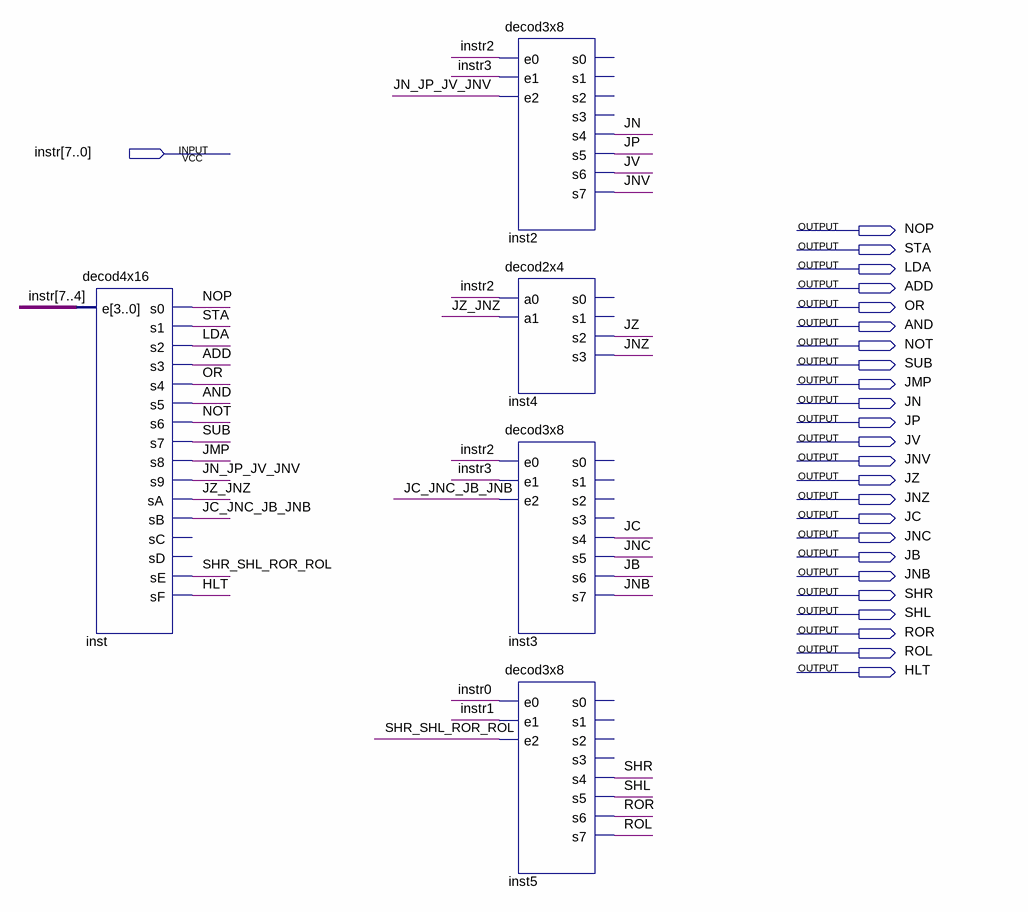
[diagram p0: schematic sheet]
// Quartus schematic Ahmes_instr_decod.bdf as structural Verilog: 5 symbols, 25 pins
module Ahmes_instr_decod (
  input  [7:0] instr,
  output NOP,
  output STA,
  output LDA,
  output ADD,
  output OR,
  output AND,
  output NOT,
  output SUB,
  output JMP,
  output JN,
  output JP,
  output JV,
  output JNV,
  output JZ,
  output JNZ,
  output JC,
  output JNC,
  output JB,
  output JNB,
  output SHR,
  output SHL,
  output ROR,
  output ROL,
  output HLT
);

  wire JC_JNC_JB_JNB, JN_JP_JV_JNV, JZ_JNZ, SHR_SHL_ROR_ROL;

  decod4x16 inst (
    .e(instr[7:4]), .s0(NOP), .s1(STA), .s2(LDA), .s3(ADD), .s4(OR), .s5(AND), .s6(NOT), .s7(SUB), .s8(JMP),
    .s9(JN_JP_JV_JNV), .sA(JZ_JNZ), .sB(JC_JNC_JB_JNB), .sE(SHR_SHL_ROR_ROL), .sF(HLT));  // open: sC, sD
  decod3x8 inst2 (
    .e0(instr[2]), .e1(instr[3]), .e2(JN_JP_JV_JNV), .s4(JN), .s5(JP), .s6(JV), .s7(JNV));  // open: s0, s1, s2, s3
  decod2x4 inst4 (.a0(instr[2]), .a1(JZ_JNZ), .s2(JZ), .s3(JNZ));  // open: s0, s1
  decod3x8 inst3 (
    .e0(instr[2]), .e1(instr[3]), .e2(JC_JNC_JB_JNB), .s4(JC), .s5(JNC), .s6(JB), .s7(JNB));  // open: s0, s1, s2, s3
  decod3x8 inst5 (
    .e0(instr[0]), .e1(instr[1]), .e2(SHR_SHL_ROR_ROL), .s4(SHR), .s5(SHL), .s6(ROR), .s7(ROL));  // open: s0, s1, s2, s3
endmodule
